# Altium schematic sheet PowerMeter_BLK.SchDoc: Power Meter - Block Diagram
size A4; Author: SfARA, Gonzalo Agustín; CompanyName: Introducción al Diseño de Circuitos Impresos; Organization: UTN FRBA; Revision: 00; SheetNumber: 1; SheetTotal: 5
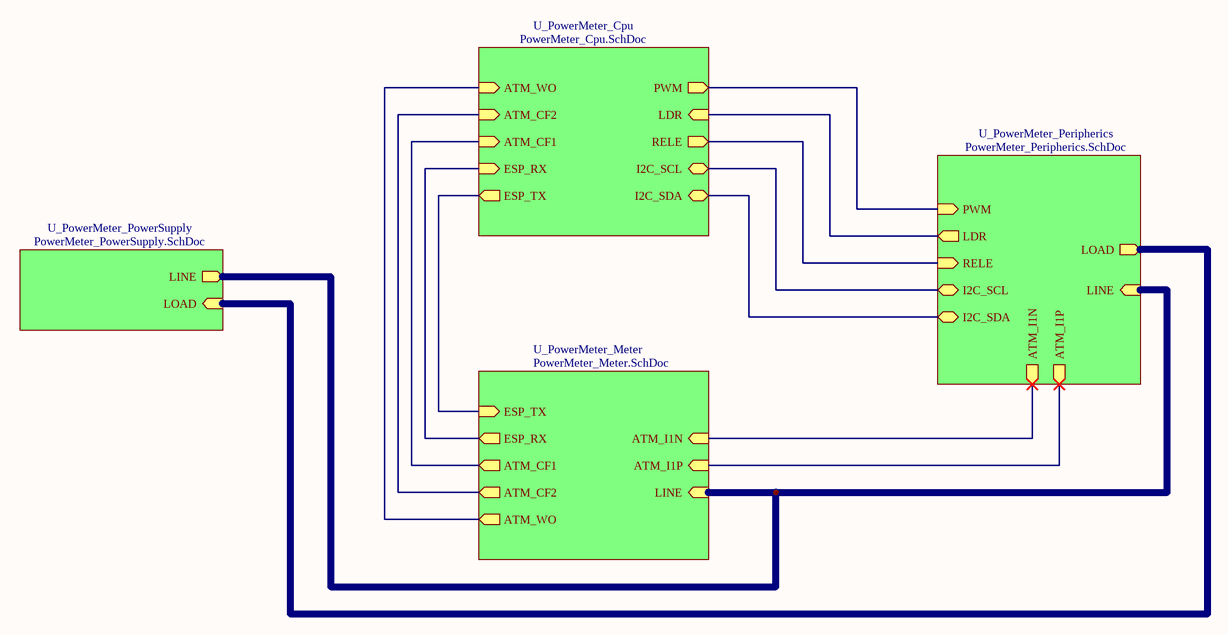
[diagram p0: PowerMeter_BLK.SchDoc]

## Sub-sheets
U_PowerMeter_Cpu = PowerMeter_Cpu.SchDoc: LDR (in), PWM (out), I2C_SCL (bidir), ATM_CF2 (in), ATM_CF1 (in), I2C_SDA (bidir), ESP_RX (in), ESP_TX (out), ATM_WO (in), RELE (out)
U_PowerMeter_Meter = PowerMeter_Meter.SchDoc: ATM_I1P (in), ATM_I1N (in), ATM_CF2 (out), ATM_CF1 (out), ATM_WO (out), ESP_RX (out), ESP_TX (in), LINE (in)
U_PowerMeter_Peripherics = PowerMeter_Peripherics.SchDoc: RELE (in), LINE (in), LDR (out), I2C_SCL (bidir), I2C_SDA (bidir), ATM_I1P (out), ATM_I1N (out), LOAD (out), PWM (in)
U_PowerMeter_PowerSupply = PowerMeter_PowerSupply.SchDoc: LINE (out), LOAD (in)

## Nets
(unnamed): sheet U_PowerMeter_Cpu/LDR, sheet U_PowerMeter_Peripherics/LDR
(unnamed): sheet U_PowerMeter_Cpu/PWM, sheet U_PowerMeter_Peripherics/PWM
(unnamed): sheet U_PowerMeter_Cpu/I2C_SCL, sheet U_PowerMeter_Peripherics/I2C_SCL
(unnamed): sheet U_PowerMeter_Cpu/ATM_CF2, sheet U_PowerMeter_Meter/ATM_CF2
(unnamed): sheet U_PowerMeter_Cpu/ATM_CF1, sheet U_PowerMeter_Meter/ATM_CF1
(unnamed): sheet U_PowerMeter_Cpu/I2C_SDA, sheet U_PowerMeter_Peripherics/I2C_SDA
(unnamed): sheet U_PowerMeter_Cpu/ESP_RX, sheet U_PowerMeter_Meter/ESP_RX
(unnamed): sheet U_PowerMeter_Cpu/ESP_TX, sheet U_PowerMeter_Meter/ESP_TX
(unnamed): sheet U_PowerMeter_Cpu/ATM_WO, sheet U_PowerMeter_Meter/ATM_WO
(unnamed): sheet U_PowerMeter_Cpu/RELE, sheet U_PowerMeter_Peripherics/RELE
(unnamed): sheet U_PowerMeter_Meter/ATM_I1P, sheet U_PowerMeter_Peripherics/ATM_I1P
(unnamed): sheet U_PowerMeter_Meter/ATM_I1N, sheet U_PowerMeter_Peripherics/ATM_I1N
(unnamed): sheet U_PowerMeter_Meter/LINE, sheet U_PowerMeter_Peripherics/LINE, sheet U_PowerMeter_PowerSupply/LINE
(unnamed): sheet U_PowerMeter_Peripherics/LOAD, sheet U_PowerMeter_PowerSupply/LOAD

## Notes on the sheet
- Title:
- Size:
- Author:
- A4
- Sheet
- of
- Revision:
- File:
- Date: